# Altium schematic sheet Sheet1_MCU.SchDoc
size 420 x 297 mm; SheetNumber: 1; SheetTotal: 2; 2oboznachenieDocumenta: АСТА.468353.020 Э3; 1.2naimenovanieDocumenta: Схема электрическая принципиальная; 1.1.2naimenovanieIzdeliyaNiznyaya: Плата UART-Ethernet; 7poryadkoviiNomerLista: 1; 8obscheeKolichestvoListov: 2; 9naimenovanieOrganizacii: ООО"СТАЛТ"; 25pervichnoePrimenenie: АСТА.468353.020; 11.1familiyaRazrabotchika: Калнагуз; 11.2familiyaProveryauschego: Акбашев; 11.5familiyaNormKontrolya: Цирценс; 11.6familiyaUtverzhdauschego: Несин; 13.1dataPodpisiRazrabotchika: 1,06,23; 13.2dataPodpisiProveryauschego: 1,06,23
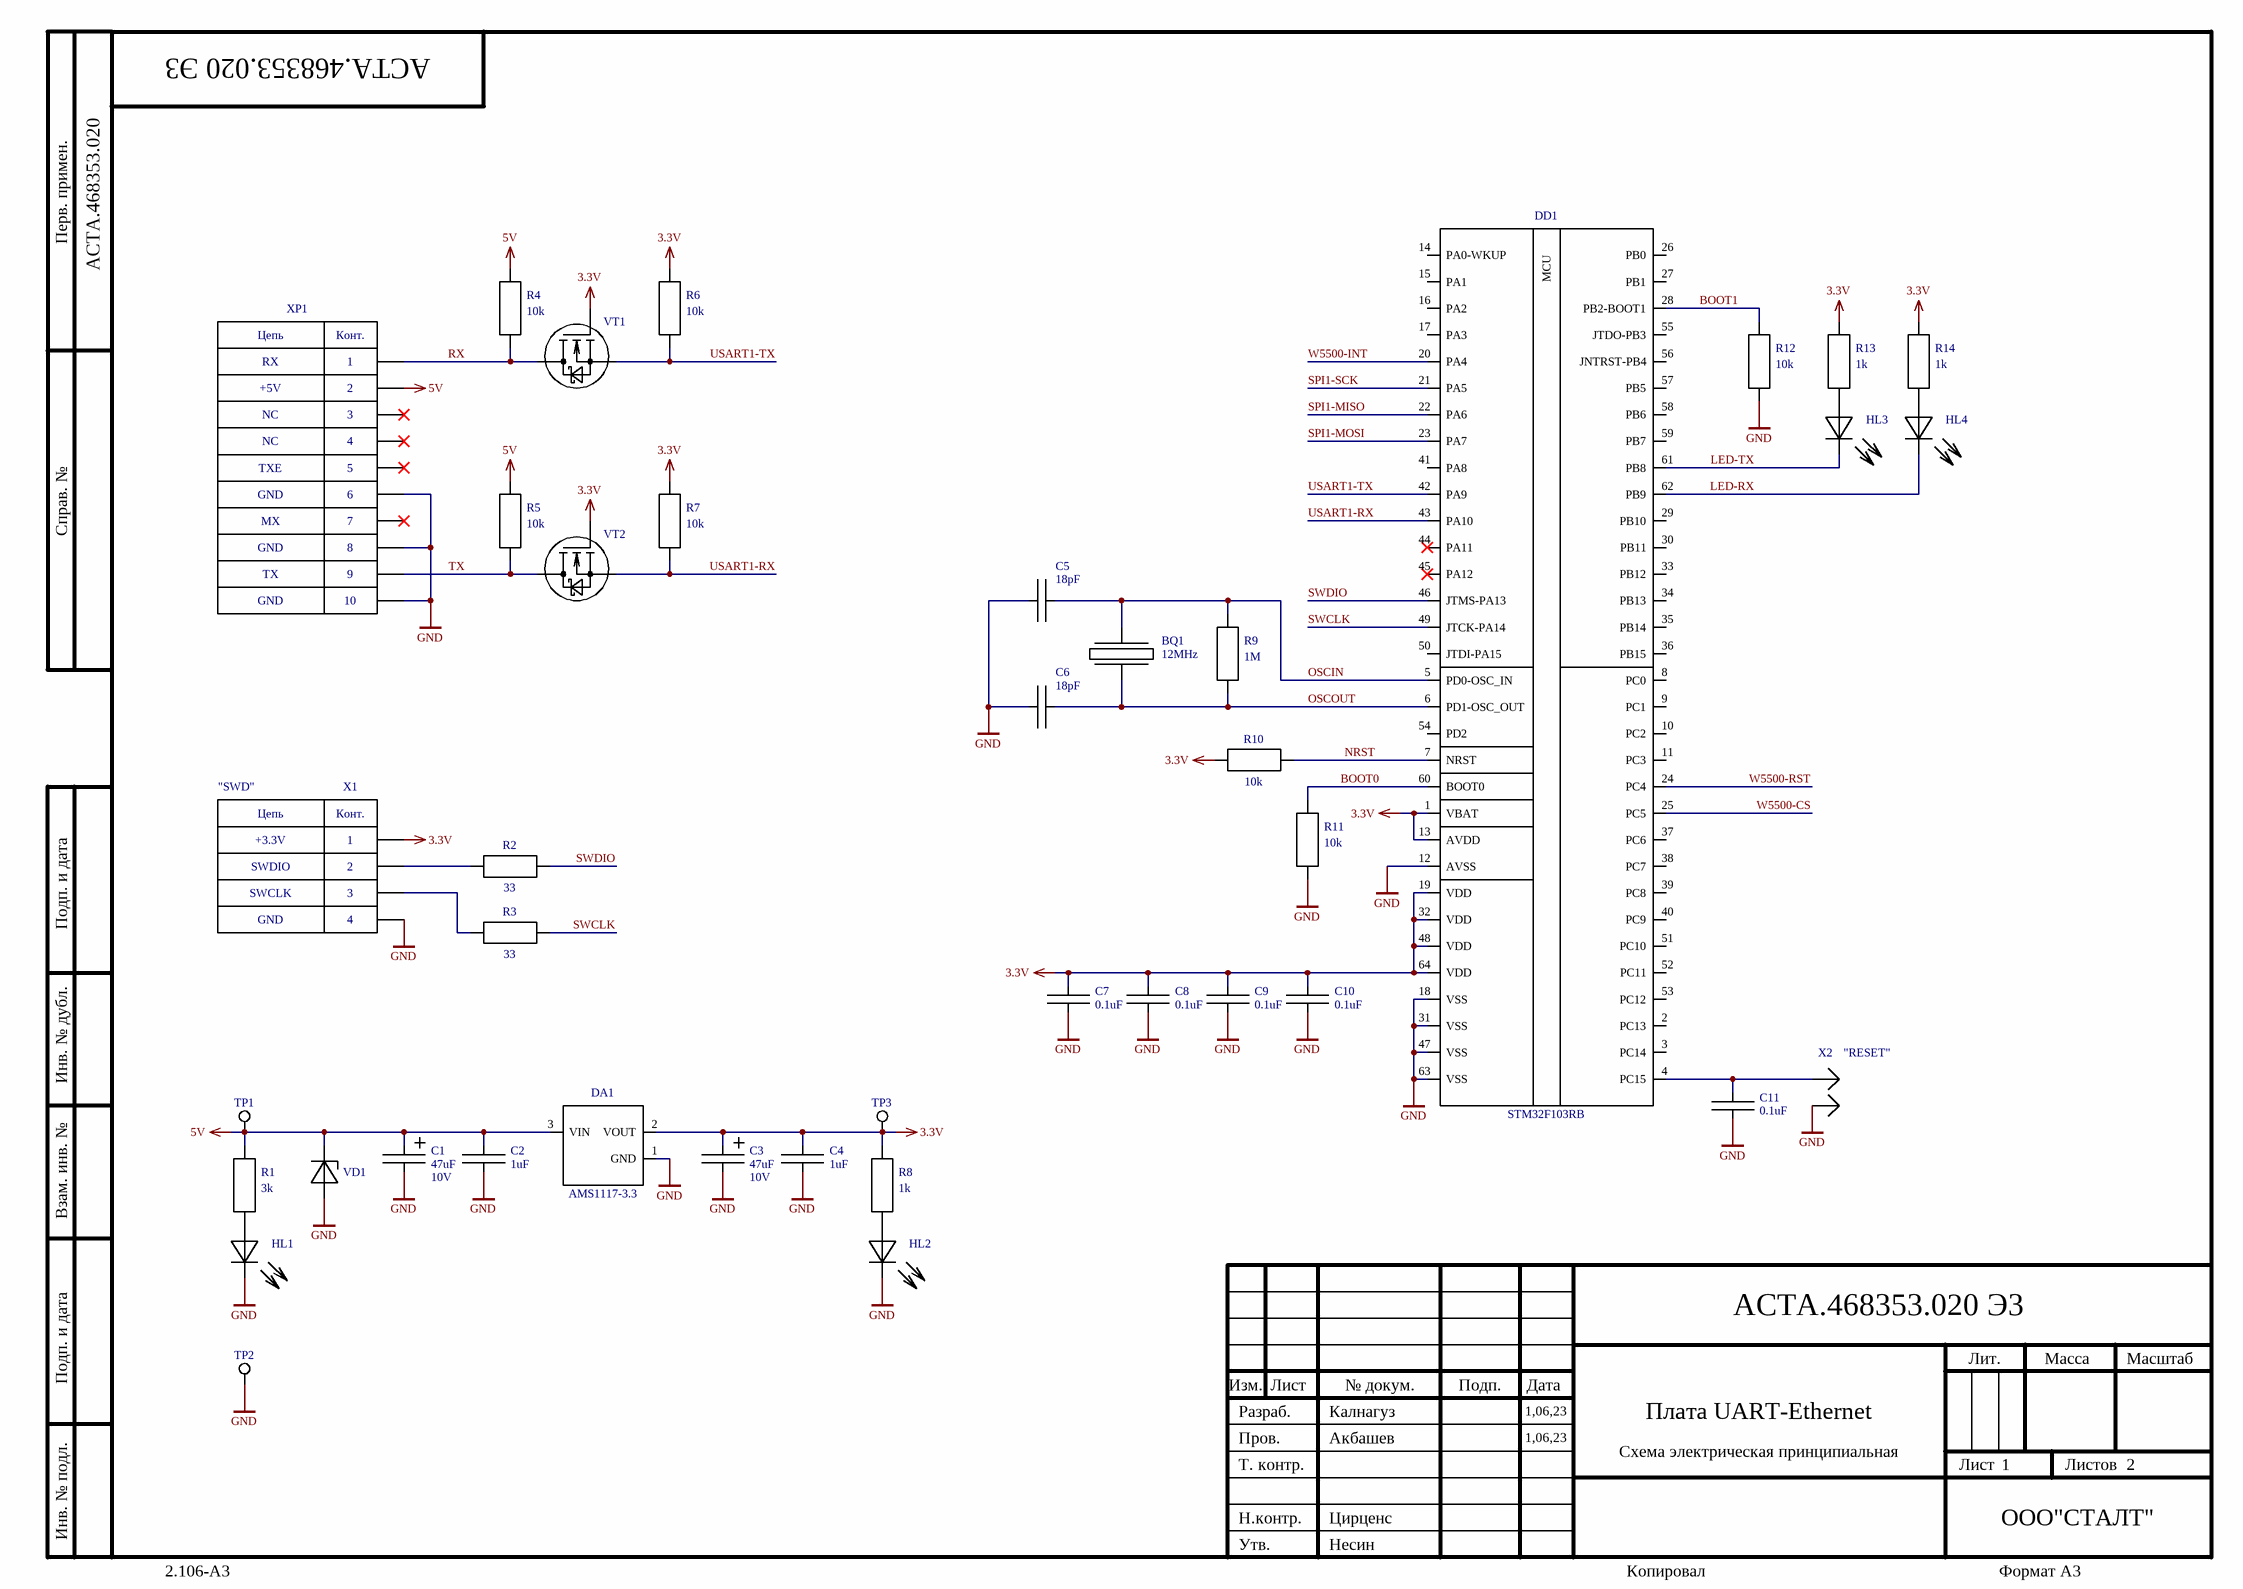
[diagram p0: Sheet1_MCU.SchDoc]

## Parts
BQ1  value 12MHz  [HT-49S]  (hidden comment: HT-49S_Rated)
C1  value 47uF  Voltage: 10V  [CaseB_TantalumCap]  (hidden comment: CaseB_TantalumCap)
C2  value 1uF  [CAP0805]  (hidden comment: CAP0805_Rated)
C3  value 47uF  Voltage: 10V  [CaseB_TantalumCap]  (hidden comment: CaseB_TantalumCap)
C4  value 1uF  [CAP0805]  (hidden comment: CAP0805_Rated)
C5  value 18pF  [CAP0805]  (hidden comment: CAP0805_Rated)
C6  value 18pF  [CAP0805]  (hidden comment: CAP0805_Rated)
C7  value 0.1uF  [CAP0805]  (hidden comment: CAP0805_Rated)
C8  value 0.1uF  [CAP0805]  (hidden comment: CAP0805_Rated)
C9  value 0.1uF  [CAP0805]  (hidden comment: CAP0805_Rated)
C10  value 0.1uF  [CAP0805]  (hidden comment: CAP0805_Rated)
C11  value 0.1uF  [CAP0805]  (hidden comment: CAP0805_Rated)
DA1  AMS1117-3.3  [SOT-223]
DD1  STM32F103RB  [LQFP-64]
HL1  KPTD-3216MGC  [KPTD-3216 Green]  (value not drawn)
HL2  KPTD-3216MGC  [KPTD-3216 Green]  (value not drawn)
HL3  KPTD-3216MGC  [KPTD-3216 Green]  (value not drawn)
HL4  KPTD-3216SYC  [KPTD-3216 Yellow]  (value not drawn)
R1  value 3k  [RES0805]  (hidden comment: RES0805_Rated)
R2  value 33  [RES0805]  (hidden comment: RES0805_Rated)
R3  value 33  [RES0805]  (hidden comment: RES0805_Rated)
R4  value 10k  [RES0805]  (hidden comment: RES0805_Rated)
R5  value 10k  [RES0805]  (hidden comment: RES0805_Rated)
R6  value 10k  [RES0805]  (hidden comment: RES0805_Rated)
R7  value 10k  [RES0805]  (hidden comment: RES0805_Rated)
R8  value 1k  [RES0805]  (hidden comment: RES0805_Rated)
R9  value 1M  [RES0805]  (hidden comment: RES0805_Rated)
R10  value 10k  [RES0805]  (hidden comment: RES0805_Rated)
R11  value 10k  [RES0805]  (hidden comment: RES0805_Rated)
R12  value 10k  [RES0805]  (hidden comment: RES0805_Rated)
R13  value 1k  [RES0805]  (hidden comment: RES0805_Rated)
R14  value 1k  [RES0805]  (hidden comment: RES0805_Rated)
TP1  TestPad  [PAD-TH-OCT1x1-0.5]  (value not drawn)  (no BOM)
TP2  TestPad  [PAD-TH-OCT1x1-0.5]  (value not drawn)  (no BOM)
TP3  TestPad  [PAD-TH-OCT1x1-0.5]  (value not drawn)  (no BOM)
VD1  SMAJ5.0A  [SMA (DO-214AC)]  (value not drawn)
VT1  BSS138  [SOT-23]  (value not drawn)
VT2  BSS138  [SOT-23]  (value not drawn)
X1  Circuit4: GND  Circuit3: SWCLK  Circuit1: +3.3V  Circuit2: SWDIO  Label: "SWD"  [PBS-4]  (hidden comment: PBS-4)
X2  Label: "RESET"  [PLS-2]  (hidden comment: PLS-2)
XP1  Circuit7: MX  Circuit8: GND  Circuit9: TX  Circuit4: NC  Circuit5: TXE  Circuit2: +5V  Circuit1: RX  [IDC-10MS pad1.6x2.0]  (hidden comment: IDC-10MS)

## Nets
3.3V: C3.1(+) C4.1 C7.1 C8.1 C9.1 C10.1 DA1.2(VOUT) DD1.1(VBAT) DD1.13(AVDD) DD1.19(VDD) DD1.32(VDD) DD1.48(VDD) DD1.64(VDD) R6.2 R7.2 R8.2 R10.1 R13.2 R14.2 TP3.1 VT1.1(G) VT2.1(G) X1.1
5V: C1.1(+) C2.1 DA1.3(VIN) R1.2 R4.2 R5.2 TP1.1 VD1.K XP1.2
GND: C1.2(-) C2.2 C3.2(-) C4.2 C5.1 C6.1 C7.2 C8.2 C9.2 C10.2 C11.2 DA1.1(GND) DD1.12(AVSS) DD1.18(VSS) DD1.31(VSS) DD1.47(VSS) DD1.63(VSS) HL1.K HL2.K R11.1 R12.1 TP2.1 VD1.A X1.4 X2.2 XP1.6 XP1.8 XP1.10
BOOT0: DD1.60(BOOT0) R11.2
BOOT1: DD1.28(PB2-BOOT1) R12.2
LED-RX: DD1.62(PB9) HL4.K
LED-TX: DD1.61(PB8) HL3.K
NRST: DD1.7(NRST) R10.2
OSCIN: BQ1.1 C5.2 DD1.5(PD0-OSC_IN) R9.2
OSCOUT: BQ1.2 C6.2 DD1.6(PD1-OSC_OUT) R9.1
RX: R4.1 VT1.2(D) XP1.1
SPI1-MISO: DD1.22(PA6)
SPI1-MOSI: DD1.23(PA7)
SPI1-SCK: DD1.21(PA5)
SWCLK: DD1.49(JTCK-PA14) R3.2
SWDIO: DD1.46(JTMS-PA13) R2.2
TX: R5.1 VT2.2(D) XP1.9
USART1-RX: DD1.43(PA10) R7.1 VT2.3(S)
USART1-TX: DD1.42(PA9) R6.1 VT1.3(S)
W5500-CS: DD1.25(PC5)
W5500-INT: DD1.20(PA4)
W5500-RST: DD1.24(PC4)
NetC11_1: C11.1 DD1.4(PC15) X2.1
NetHL1_A: HL1.A R1.1
NetHL2_A: HL2.A R8.1
NetHL3_A: HL3.A R13.1
NetHL4_A: HL4.A R14.1
NetR2_1: R2.1 X1.2
NetR3_1: R3.1 X1.3

Not connected (* = marked no-connect by the designer): DD1 2(PC13) 3(PC14) 8(PC0) 9(PC1) 10(PC2) 11(PC3) 14(PA0-WKUP) 15(PA1) 16(PA2) 17(PA3) 26(PB0) 27(PB1) 29(PB10) 30(PB11) 33(PB12) 34(PB13) 35(PB14) 36(PB15) 37(PC6) 38(PC7) 39(PC8) 40(PC9) 41(PA8) 44(PA11)* 45(PA12)* 50(JTDI-PA15) 51(PC10) 52(PC11) 53(PC12) 54(PD2) 55(JTDO-PB3) 56(JNTRST-PB4) 57(PB5) 58(PB6) 59(PB7); XP1 3* 4* 5* 7*

## Notes on the sheet
- Перв. примен.
- Справ. №
- Подп. и дата
- Инв. № дубл.
- Взам. инв. №
- Разраб.
- Изм.
- Лист
- № докум.
- Подп.
- Дата
- Лит.
- Масса
- Масштаб
- Пров.
- Т. контр.
- Листов
- Инв. № подл.
- Н.контр.
- Утв.
- 2.106-A3
- Копировал
- Формат А3
- (in symbol IDC-10MS) Цепь; Конт.
- (in symbol PBS-4) Цепь; Конт.
- (in symbol STM32F103RB) MCU

## Library data of the parts
DA1 = AMS1117-3.3: Fixed Voltage 3.3V 1A Low Dropout Voltage Regulator
DD1 = STM32F103RB: ARM Cortex-M3 MCU
HL1-HL3 = KPTD-3216MGC: 3.2x1.6mm SMD LED Mega Green
HL4 = KPTD-3216SYC: 3.2x1.6mm SMD LED Super Bright Yellow
R1-R14 = RES0805_Rated: Tolerance: 5%; 1Ccode: *; 1Cname: *; 1CfullName: *; 1Cgroup: *; 1Carticle: *; Name: *; Manufacturer: *; PartNumber: *; DatasheetLink: *; Case: *
TP1-TP3 = TestPad: TestPoint on PCB; Label: "Label"
VD1 = SMAJ5.0A: 5Vr 400W 43.5A UniDirectional TVS; Vbr: 6.4V
VT1 VT2 = BSS138: Small Signal N-Channel MOSFET 50V 220mA; pin to pad: 2>3 3>2; 1Ccode: М00041810; 1Cname: Транзистор BSS138; 1Cgroup: 01010104; 1Carticle: 30894; 1CfullName: Транзистор BSS138; Name: Транзистор BSS138; PartNumber: BSS138; Case: SOT-23; ComponentLink1Description: DatasheetLink; ComponentLink1URL: *; ChannelPolarity: N-Channel
X1 = PBS-4: Female Header Pitch 2.54mm; 1Ccode: *; 1Cname: *; 1CfullName: *; 1Cgroup: *; 1Carticle: *; Manufacturer: *; Name: *; PartNumber: *; ComponentLink1Description: DatasheetLink; ComponentLink1URL: *
X2 = PLS-2: Pin Header Pitch 2.54mm; Circuit1: *1; Circuit2: *2
XP1 = IDC-10MS: Box Header Pitch 2.54mm; Label: "Label"; Circuit10: GND; Circuit6: GND; Circuit3: NC
BQ1 = HT-49S_Rated: 1Ccode: *; 1Cname: *; 1CfullName: *; 1Cgroup: *; 1Carticle: *; Manufacturer: *; Name: *; PartNumber: *; Case: *; Tolerance: *; ComponentLink1Description: DatasheetLink; ComponentLink1URL: *; Frequency: *
C2 C4-C11 = CAP0805_Rated: 1Ccode: *; 1Cname: *; 1CfullName: *; 1Cgroup: *; 1Carticle: *; Manufacturer: *; Name: *; PartNumber: *; ComponentLink1Description: DatasheetLink; ComponentLink1URL: *; Case: 0805; Tolerance: *; RatedVoltage: *; TemperatureCharacteristic: *